# Altium schematic sheet Buck_3V3.SchDoc
size Legal; SheetNumber: 7; SheetTotal: 12
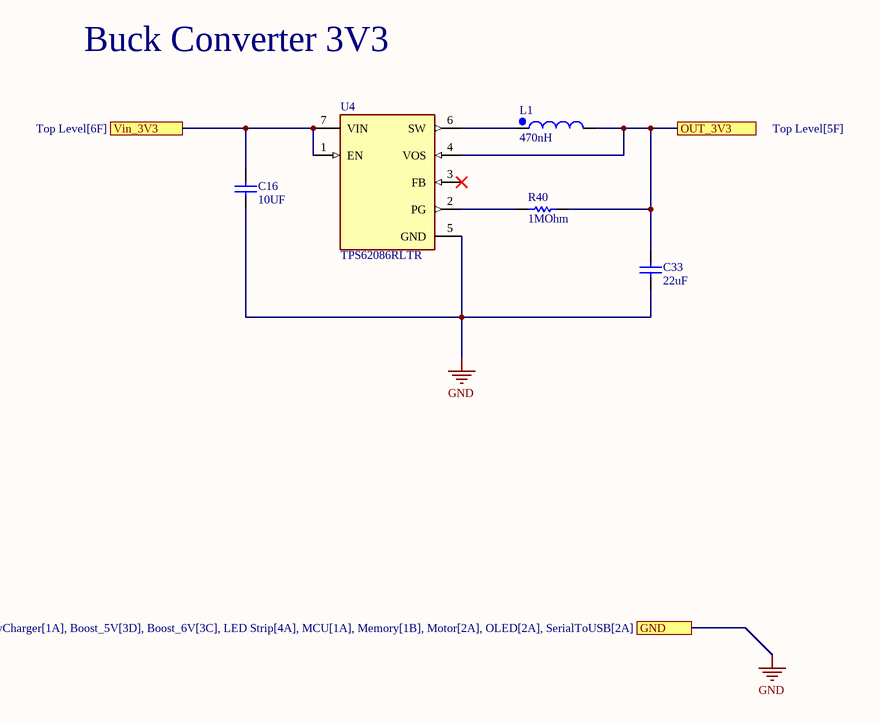
[diagram p0: Buck_3V3.SchDoc]

## Parts
C16  value 10UF  [0603_CAP]  (hidden comment: CAP 0603 10UF 16V 20% X5R)
C33  value 22uF  [0805_CAP_60H]  (hidden comment: CAP 0805 22UF 10V 20% X5R)
L1  value 470nH  [WE-LHMI_5030]  (hidden comment: 744373360047)
R40  1MOhm  [RESC1608X55X25LL10T15]
U4  TPS62086RLTR  [FP-RLT0007A-MFG]

## Ports
GND (see Top Level[6F], AI_Audio_Module[4A], BatteryCharger[1A], Boost_5V[3D], Boost_6V[3C], LED Strip[4A], MCU[1A], Memory[1B], Motor[2A], OLED[2A], SerialToUSB[2A]), OUT_3V3 (see Top Level[5F]), Vin_3V3 (see Top Level[6F])

## Nets
GND: C16.1 C33.1 U4.5(GND) ; port GND
OUT_3V3: C33.2 L1.2 R40.2 U4.4(VOS) ; port OUT_3V3
Vin_3V3: C16.2 U4.1(EN) U4.7(VIN) ; port Vin_3V3
NetL1_1: L1.1 U4.6(SW)
NetR40_1: R40.1 U4.2(PG)

Not connected (* = marked no-connect by the designer): U4 3(FB)*

## Notes on the sheet
- Buck Converter 3V3
- Title:
- Desc:
- Size:
- Letter
- Auth:
- Proj:
- Sheet
- of
- www.seas.upenn.edu
- Electrical and Systems Engineering

## Library data of the parts
C16 = CMP-011-000263-1: Capacitor Surface Mount 0603 Footprint 10UF 16V 20% Tolerance Ceramic X5R; Manufacturer: Various; Description in Visual: Cap SMT 0603 10UF 16V 20% Ceramic X5R; PCB Package: 0603; Type: Ceramic X5R; Mount: SMT; Tolerance: 20%; P/N: CAP 0603 10UF 16V 20% X5R; Manufacturer P/N: CAP 0603 10UF 16V 20% X5R
C33 = CMP-011-000507-1: Capacitor Surface Mount 0805 Footprint 22UF 10V 20% Tolerance Ceramic X5R; Manufacturer: Various; PCB Package: 0805; Description in Visual: Cap SMT 0805 22UF 10V 20%  Cer X5R; Tolerance: 20%; P/N: CAP 0805 22UF 10V 20% X5R; Manufacturer P/N: CAP 0805 22UF 10V 20% X5R; Mount: SMT; Voltage: 10V; Type: Ceramic X5R
L1 = CMP-002-000030-2: General Purpose Inductor, 0.47uH, 20%, 1 Element, Powdered  Iron-Core, SMD, 2220; Current (Saturation): 21.5A; Current (Max): 9.2A; JESD-609 Code: e2; Reach SVHC Compliant: Yes; Terminal Finish: Copper; Inductor Type: GENERAL PURPOSE INDUCTOR; RoHS Compliant: Yes; Manufacturer Series: 744373360047
R40 = CMP-1659-00056-1: Chip Resistor, 1 MOhm, +/- 1%, 100 mW, -55 to 155 degC, 0603 (1608 Metric), RoHS, Tape and Reel; Voltage Rating (DC): 25 V; Tolerance: 20%; Case\Package: Radial; Capacitance: 1 mF; Min Operating Temperature: -40 degC; PackageDescription: 2-Pin Surface Mount Device, Body 1.6 x 0.8 mm; ComponentLink1Description: Manufacturer URL; Radiation Hardening: No; DatasheetVersion: Rev. 4, 02/2016; REACH SVHC: No SVHC; Length: 20 mm; Max Operating Temperature: 85 degC; Diameter: 10 mm; Packaging: Bulk; Package Quantity: 200; PackageReference: 0603; Mount: Through Hole; ComponentLink1URL: http://www.yageo.com/; ComponentLink2URL: http://www.yageo.com/documents/recent/PYu-RC_Group_51_RoHS_L_04.pdf; ComponentLink2Description: Datasheet; Width: 0 inch; Lead Pitch: 5 mm; RoHSCompliant: true; Voltage Rating: 25 V; Height: 20 mm
U4 = CMP-04918-000186-1: IC REG BUCK 3.3V 3A 7VSON-HR; Switching Frequency: 2.4MHz; Output Type: Fixed; Output Configuration: Positive; Synchronous Rectifier: Yes; Min Input Voltage: 2.5V; Operating Supply Voltage: 6V; Efficiency: 95%; Number of Outputs: 1; Package Quantity: 3000; Packaging: Tape and Reel; Output Voltage: 3.3V; Case/Package: VQFN; RoHS Compliant: Yes; Output Current: 3A; Max Input Voltage: 6V; Min Operating Temperature: -40°C; Lead Free: Lead Free; Max Operating Temperature: 125°C; Mount: Surface Mount; Number of Pins: 7; Min Output Voltage: 3.3V; Radiation Hardening: No; Max Output Current: 3A